# EAGLE design batteryCase (EAGLE 7.4.0)
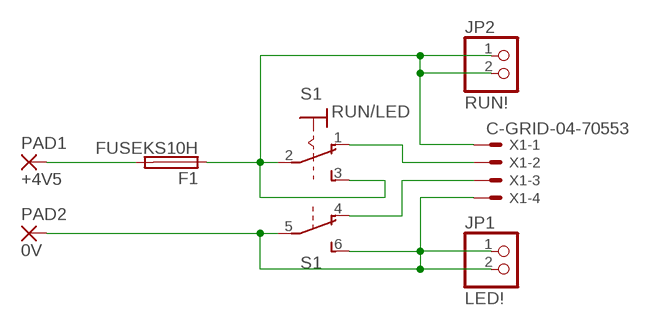
[diagram p0: schematic, sheet 1]

## Parts
F1  FUSEKS10H  [KS10H]
JP1  LED!  PINHD-1X2/90  [1X02/90]
JP2  RUN!  PINHD-1X2/90  [1X02/90]
PAD1  +4V5  SMD5  [SMD2,54-5,08]
PAD2  0V  SMD5  [SMD2,54-5,08]
S1  RUN/LED  M9040P2  [M9040P2]
X1  C-GRID-04-70553  [70553-04]

## Nets
N$1: F1.2 PAD1.1(P)
N$2: JP1.1 JP1.2 PAD2.1(P) S1.5(2:P) S1.6(2:S) X1.4
N$3: F1.1 JP2.1 JP2.2 S1.2(1:P) S1.3(1:S) X1.1
N$4: S1.1(1:O) X1.2
N$5: S1.4(2:O) X1.3

## Library data of the parts
F1 = fuse:FUSE: Fuse; OC_FARNELL: unknown; OC_NEWARK: unknown
JP1 JP2 = pinhead:PINHD-1X2: PIN HEADER
PAD1 PAD2 = wirepad:SMD5: SMD PAD
S1 = switch:M9040P2: TOGGLE SWITCH Marquardt
X1 = con-molex:C-GRID-04: CONNECTOR wire to board 2.54 mm (0.100") pitch header; OC_FARNELL: unknown; OC_NEWARK: unknown

## Board
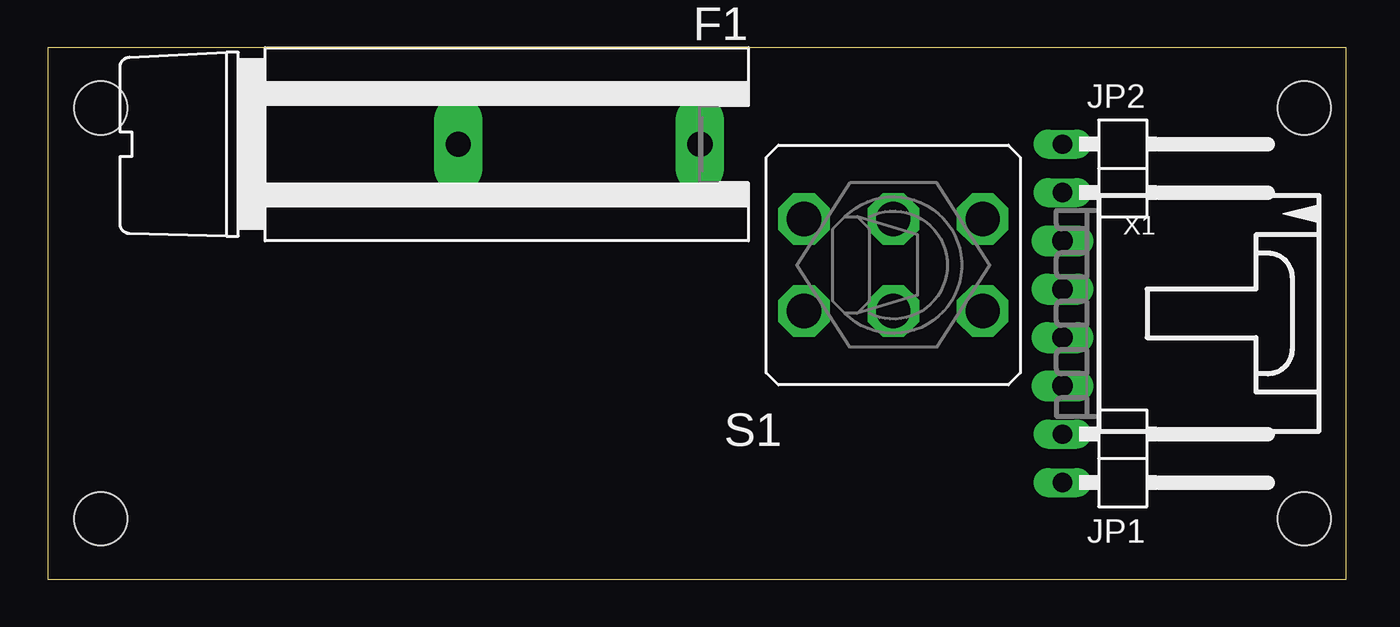
[diagram p1: board, top side]
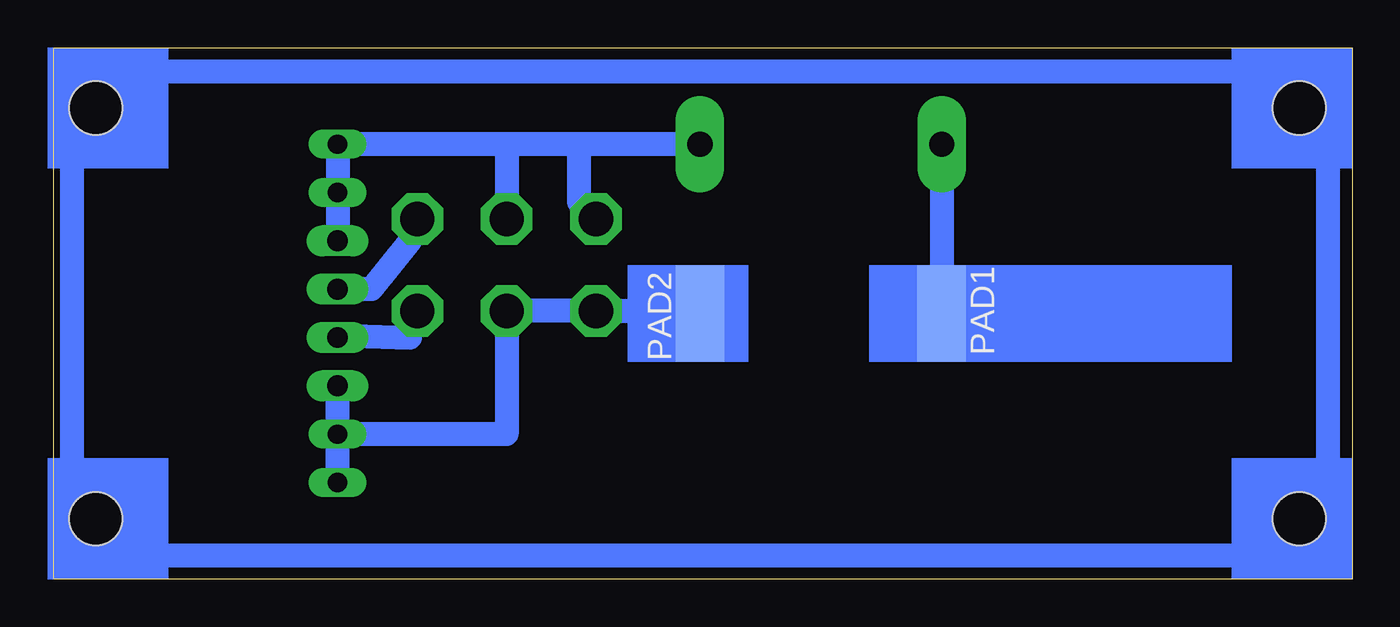
[diagram p2: board, bottom side, seen from below]

Size 68.25 x 27.93 mm. Coordinates in mm from the lower left corner, seen from the top.
Outline: 0,0 68.25,0 68.25,27.93 0,27.93 0,0
Copper layers (1*16): Top 0.035mm / dielectric 1.5mm / Bottom 0.035mm
Design rules "default": minimum track width 10mil, minimum drill 24mil, track to track 8mil, track to pad 8mil, pad to pad 8mil, via to via 8mil, smd to smd 8mil, copper to edge 40mil, drill to drill 8mil, minimum pad ring 10mil, minimum via ring 8mil, stop-mask expansion 4mil, vias tented up to drill 0mil, thermal gap 10mil
Holes 2.8 mm at 2.79,3.17 2.79,24.77 66.04,3.17 66.04,24.77

### Footprints (pad centres in the part's own frame; a part is rotated, then mirrored left to right if it is on the bottom)
KS10H = drill 1.321 pad 2.54 long: 1 0,-5.08; 2 0,7.62
1X02/90 = drill 1.016 long: 1 -1.27,-3.81; 2 1.27,-3.81
SMD2,54-5,08 = smd 2.54 x 5.08: 1 0,0
M9040P2 = drill 1.803 octagon: 1 -2.413,4.699; 2 -2.413,0; 3 -2.413,-4.699; 4 2.413,4.699; 5 2.413,0; 6 2.413,-4.699
70553-04 = drill 1.092 long: 1 -3.81,-7.62; 2 -1.27,-7.62; 3 1.27,-7.62; 4 3.81,-7.62

### Placement (x,y rotation side)
F1  29.21,22.86 90 top
JP1  57.15,6.35 270 top
JP2  57.15,21.59 270 top
PAD1  21.59,13.97 180 bottom
PAD2  34.29,13.97 0 bottom
S1  44.45,16.51 270 top
X1  60.96,13.97 270 top

### Tracks (layer width: path | path; a pad name or v marks a point on that pad's centre or on a via)
N$1
  Bottom 1.27: F1.2 PAD1.1
N$2
  Bottom 1.27: JP1.2 JP1.1 | PAD2.1 34.42,14.1 S1.6 S1.5 44.45,7.62 JP1.1 | JP1.1 X1.4
N$3
  Bottom 1.27: X1.1 JP2.2 JP2.1 44.45,22.86 | 40.64,22.86 44.45,22.86 | 44.45,22.86 S1.2 | S1.3 40.64,19.81 40.64,22.86 | F1.1 40.64,22.86
N$4
  Bottom 1.27: S1.1 49.53,18.92 49.53,17.78 51.56,15.24 X1.2
N$5
  Bottom 1.27: X1.3 53.34,12.83 49.53,12.7 49.53,14.1 S1.4
N$6
  Bottom 1.27: 1.27,26.67 67.31,26.67 67.31,1.27 1.27,1.27 1.27,26.67
(copper drawn outside any net)
  shapes: Bottom area x6